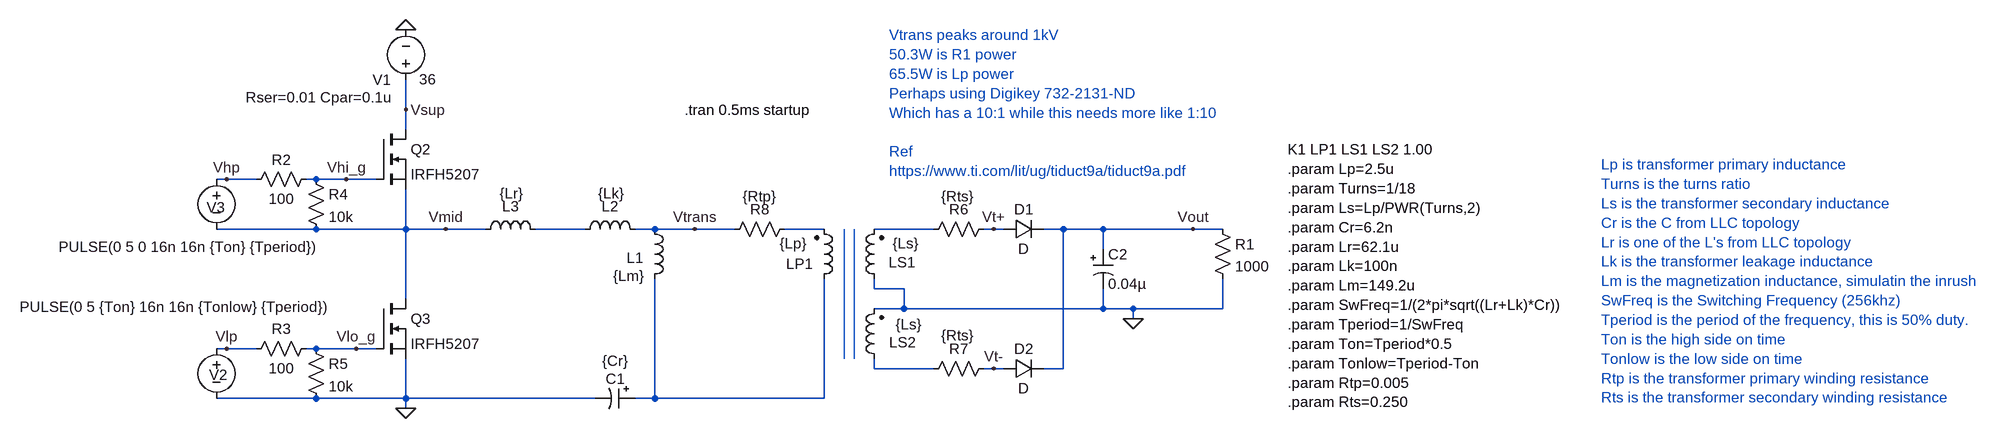
[diagram p0: schematic LLC-ZVS_Boost.asc]
LLC-ZVS_Boost.asc, the LTspice schematic file:
Version 4
SHEET 1 3192 680
WIRE 240 -176 240 -224
WIRE 240 -144 240 -176
WIRE -48 -64 -64 -64
WIRE 0 -64 -48 -64
WIRE 96 -64 80 -64
WIRE 144 -64 96 -64
WIRE 192 -64 144 -64
WIRE 96 16 -64 16
WIRE 240 16 240 -48
WIRE 240 16 96 16
WIRE 304 16 240 16
WIRE 368 16 304 16
WIRE 528 16 448 16
WIRE 640 16 608 16
WIRE 704 16 640 16
WIRE 768 16 704 16
WIRE 912 16 848 16
WIRE 1088 16 992 16
WIRE 1184 16 1168 16
WIRE 1200 16 1184 16
WIRE 1296 16 1264 16
WIRE 1360 16 1296 16
WIRE 1504 16 1360 16
WIRE 1552 16 1504 16
WIRE 1360 48 1360 16
WIRE 992 112 992 96
WIRE 1040 112 992 112
WIRE 240 128 240 16
WIRE 1040 144 1040 112
WIRE 1040 144 992 144
WIRE 1360 144 1360 112
WIRE 1360 144 1040 144
WIRE 1408 144 1360 144
WIRE 1552 144 1552 96
WIRE 1552 144 1408 144
WIRE 1408 160 1408 144
WIRE -48 208 -64 208
WIRE 0 208 -48 208
WIRE 96 208 80 208
WIRE 160 208 96 208
WIRE 192 208 160 208
WIRE 992 240 992 224
WIRE 1088 240 992 240
WIRE 1184 240 1168 240
WIRE 1200 240 1184 240
WIRE 1296 240 1296 16
WIRE 1296 240 1264 240
WIRE 96 288 -64 288
WIRE 240 288 240 224
WIRE 240 288 96 288
WIRE 544 288 240 288
WIRE 640 288 640 96
WIRE 640 288 608 288
WIRE 912 288 912 96
WIRE 912 288 640 288
WIRE 240 304 240 288
FLAG 240 304 0
FLAG 240 -304 0
FLAG 1504 16 Vout
FLAG 144 -64 Vhi_g
FLAG 160 208 Vlo_g
FLAG 304 16 Vmid
FLAG -48 -64 Vhp
FLAG -48 208 Vlp
FLAG 240 -176 Vsup
FLAG 1408 160 0
FLAG 1184 16 Vt+
FLAG 1184 240 Vt-
FLAG 704 16 Vtrans
SYMBOL res 1536 0 R0
SYMATTR InstName R1
SYMATTR Value 1000
SYMBOL voltage 240 -208 R180
WINDOW 123 0 0 Left 0
WINDOW 39 24 -12 Left 2
WINDOW 3 -48 17 Left 2
SYMATTR SpiceLine Rser=0.01 Cpar=0.1u
SYMATTR Value 36
SYMATTR InstName V1
SYMBOL voltage -64 192 R0
WINDOW 0 -12 58 Left 2
WINDOW 3 -316 -51 Left 2
WINDOW 123 0 0 Left 0
WINDOW 39 0 0 Left 0
SYMATTR InstName V2
SYMATTR Value PULSE(0 5 {Ton} 16n 16n {Tonlow} {Tperiod})
SYMBOL res 96 -80 R90
WINDOW 0 0 56 VBottom 2
WINDOW 3 32 56 VTop 2
SYMATTR InstName R2
SYMATTR Value 100
SYMBOL res 96 192 R90
WINDOW 0 0 56 VBottom 2
WINDOW 3 32 56 VTop 2
SYMATTR InstName R3
SYMATTR Value 100
SYMBOL res 80 -80 R0
SYMATTR InstName R4
SYMATTR Value 10k
SYMBOL res 80 192 R0
SYMATTR InstName R5
SYMATTR Value 10k
SYMBOL polcap 608 272 R90
WINDOW 3 -60 32 VTop 2
WINDOW 0 0 32 VBottom 2
SYMATTR Value {Cr}
SYMATTR InstName C1
SYMATTR Description Capacitor
SYMATTR Type cap
SYMATTR SpiceLine V=100 Irms=1.88 Rser=0.013 Lser=6.47n mfg="Würth Elektronik" pn="860040880011 WCAP-ATUL 16x35,5" type="Al electrolytic"
SYMBOL ind 512 32 R270
WINDOW 0 37 56 VTop 2
WINDOW 3 89 58 VBottom 2
SYMATTR InstName L2
SYMATTR Value {Lk}
SYMATTR SpiceLine Ipk=17.2 Rser=0.01313 Rpar=21316 Cpar=20.57p mfg="Würth Elektronik" pn="7443783533650 WE-HCFT 3533"
SYMBOL voltage -64 -80 R0
WINDOW 0 -16 61 Left 2
WINDOW 3 -254 124 Left 2
WINDOW 123 0 0 Left 0
WINDOW 39 0 0 Left 0
SYMATTR InstName V3
SYMATTR Value PULSE(0 5 0 16n 16n {Ton} {Tperiod})
SYMBOL nmos 192 -144 R0
SYMATTR InstName Q2
SYMATTR Value IRFH5207
SYMBOL nmos 192 128 R0
SYMATTR InstName Q3
SYMATTR Value IRFH5207
SYMBOL ind 624 0 R0
WINDOW 0 -29 62 Left 2
WINDOW 3 -51 91 Left 2
SYMATTR InstName L1
SYMATTR Value {Lm}
SYMATTR SpiceLine Ipk=2.64 Rser=0.353 Rpar=34207.5 Cpar=0 mfg="Bourns, Inc." pn="SRF1280-470M-series"
SYMBOL diode 1200 0 M90
WINDOW 0 0 32 VBottom 2
WINDOW 3 32 32 VTop 2
SYMATTR InstName D1
SYMBOL diode 1200 224 M90
WINDOW 0 0 32 VBottom 2
WINDOW 3 32 32 VTop 2
SYMATTR InstName D2
SYMBOL polcap 1344 48 R0
SYMATTR Value 0.04µ
SYMATTR InstName C2
SYMATTR Description Capacitor
SYMATTR Type cap
SYMATTR SpiceLine V=100 Irms=1.88 Rser=0.013 Lser=6.47n mfg="Würth Elektronik" pn="860040880011 WCAP-ATUL 16x35,5" type="Al electrolytic"
SYMBOL ind2 896 112 M180
WINDOW 0 -45 40 Left 2
WINDOW 3 -56 73 Left 2
SYMATTR InstName LP1
SYMATTR Value {Lp}
SYMATTR Type ind
SYMBOL ind2 1008 112 R180
WINDOW 0 -50 43 Left 2
WINDOW 3 -56 73 Left 2
SYMATTR InstName LS1
SYMATTR Value {Ls}
SYMATTR Type ind
SYMBOL ind2 1008 240 R180
WINDOW 0 -51 42 Left 2
WINDOW 3 -61 71 Left 2
SYMATTR InstName LS2
SYMATTR Value {Ls}
SYMATTR Type ind
SYMBOL ind 352 32 R270
WINDOW 0 37 56 VTop 2
WINDOW 3 89 58 VBottom 2
SYMATTR InstName L3
SYMATTR Value {Lr}
SYMATTR SpiceLine Ipk=17.2 Rser=0.01313 Rpar=21316 Cpar=20.57p mfg="Würth Elektronik" pn="7443783533650 WE-HCFT 3533"
SYMBOL res 1184 0 R90
WINDOW 0 0 56 VBottom 2
WINDOW 3 -52 58 VTop 2
SYMATTR InstName R6
SYMATTR Value {Rts}
SYMBOL res 1184 224 R90
WINDOW 0 0 56 VBottom 2
WINDOW 3 -53 58 VTop 2
SYMATTR InstName R7
SYMATTR Value {Rts}
SYMBOL res 864 0 R90
WINDOW 0 0 56 VBottom 2
WINDOW 3 -52 56 VTop 2
SYMATTR InstName R8
SYMATTR Value {Rtp}
TEXT 688 -176 Left 2 !.tran 0.5ms startup
TEXT 1656 -112 Left 2 !K1 LP1 LS1 LS2 1.00\n.param Lp=2.5u\n.param Turns=1/18\n.param Ls=Lp/PWR(Turns,2)\n.param Cr=6.2n\n.param Lr=62.1u\n.param Lk=100n\n.param Lm=149.2u\n.param SwFreq=1/(2*pi*sqrt((Lr+Lk)*Cr))\n.param Tperiod=1/SwFreq\n.param Ton=Tperiod*0.5\n.param Tonlow=Tperiod-Ton\n.param Rtp=0.005\n.param Rts=0.250
TEXT 2160 -88 Left 2 ;Lp is transformer primary inductance\nTurns is the turns ratio\nLs is the transformer secondary inductance\nCr is the C from LLC topology\nLr is one of the L's from LLC topology\nLk is the transformer leakage inductance\nLm is the magnetization inductance, simulatin the inrush \nSwFreq is the Switching Frequency (256khz)\nTperiod is the period of the frequency, this is 50% duty.\nTon is the high side on time\nTonlow is the low side on time\nRtp is the transformer primary winding resistance\nRts is the transformer secondary winding resistance
TEXT 1016 -296 Left 2 ;Vtrans peaks around 1kV\n50.3W is R1 power\n65.5W is Lp power\nPerhaps using Digikey 732-2131-ND\nWhich has a 10:1 while this needs more like 1:10\n \nRef\nhttps://www.ti.com/lit/ug/tiduct9a/tiduct9a.pdf
LINE Normal 944 224 944 16
LINE Normal 944 224 944 224 2
LINE Normal 960 224 960 16

The netlist it stands for:
* LLC-ZVS_Boost.asc
R1 Vout 0 1000
V1 Vsup 0 36 Rser=0.01 Cpar=0.1u
V2 Vlp 0 PULSE(0 5 {Ton} 16n 16n {Tonlow} {Tperiod})
R2 Vhi_g Vhp 100
R3 Vlo_g Vlp 100
R4 Vhi_g Vmid 10k
R5 Vlo_g 0 10k
C1 N005 0 {Cr} V=100 Irms=1.88 Rser=0.013 Lser=6.47n mfg="Würth Elektronik" pn="860040880011 WCAP-ATUL 16x35,5" type="Al electrolytic"
L2 N001 Vtrans {Lk} Ipk=17.2 Rser=0.01313 Rpar=21316 Cpar=20.57p mfg="Würth Elektronik" pn="7443783533650 WE-HCFT 3533"
V3 Vhp Vmid PULSE(0 5 0 16n 16n {Ton} {Tperiod})
M§Q2 Vsup Vhi_g Vmid Vmid IRFH5207
M§Q3 Vmid Vlo_g 0 0 IRFH5207
L1 Vtrans N005 {Lm} Ipk=2.64 Rser=0.353 Rpar=34207.5 Cpar=0 mfg="Bourns, Inc." pn="SRF1280-470M-series"
D1 Vt+ Vout D
D2 Vt- Vout D
C2 Vout 0 0.04µ V=100 Irms=1.88 Rser=0.013 Lser=6.47n mfg="Würth Elektronik" pn="860040880011 WCAP-ATUL 16x35,5" type="Al electrolytic"
LP1 N005 N002 {Lp}
LS1 0 N003 {Ls}
LS2 N004 0 {Ls}
L3 Vmid N001 {Lr} Ipk=17.2 Rser=0.01313 Rpar=21316 Cpar=20.57p mfg="Würth Elektronik" pn="7443783533650 WE-HCFT 3533"
R6 Vt+ N003 {Rts}
R7 Vt- N004 {Rts}
R8 N002 Vtrans {Rtp}
.model D D
.lib standard.dio
.model NMOS NMOS
.model PMOS PMOS
.lib standard.mos
.tran 0.5ms startup
K1 LP1 LS1 LS2 1.00
.param Lp=2.5u
.param Turns=1/18
.param Ls=Lp/PWR(Turns,2)
.param Cr=6.2n
.param Lr=62.1u
.param Lk=100n
.param Lm=149.2u
.param SwFreq=1/(2*pi*sqrt((Lr+Lk)*Cr))
.param Tperiod=1/SwFreq
.param Ton=Tperiod*0.5
.param Tonlow=Tperiod-Ton
.param Rtp=0.005
.param Rts=0.250
* Lp is transformer primary inductance
* Turns is the turns ratio
* Ls is the transformer secondary inductance
* Cr is the C from LLC topology
* Lr is one of the L's from LLC topology
* Lk is the transformer leakage inductance
* Lm is the magnetization inductance, simulatin the inrush
* SwFreq is the Switching Frequency (256khz)
* Tperiod is the period of the frequency, this is 50% duty.
* Ton is the high side on time
* Tonlow is the low side on time
* Rtp is the transformer primary winding resistance
* Rts is the transformer secondary winding resistance
* Vtrans peaks around 1kV
* 50.3W is R1 power
* 65.5W is Lp power
* Perhaps using Digikey 732-2131-ND
* Which has a 10:1 while this needs more like 1:10
* Ref
* https://www.ti.com/lit/ug/tiduct9a/tiduct9a.pdf
.backanno
.end